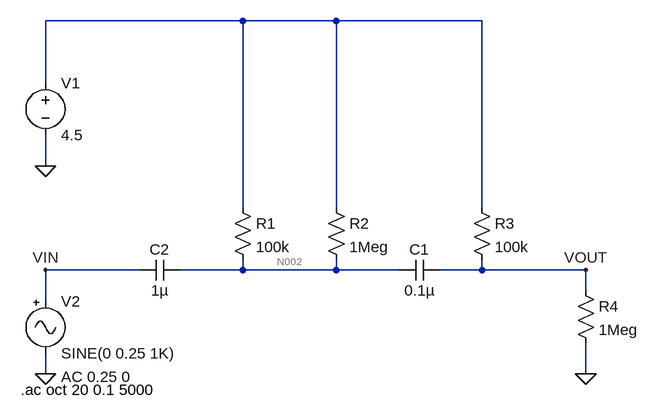
[diagram p0: schematic mt2_bypass.asc]
mt2_bypass.asc, the LTspice schematic file:
Version 4
SHEET 1 880 680
WIRE 48 -144 -256 -144
WIRE 192 -144 48 -144
WIRE 416 -144 192 -144
WIRE -256 -48 -256 -144
WIRE -256 80 -256 32
WIRE 48 144 48 -144
WIRE 192 144 192 -144
WIRE 416 144 416 -144
WIRE -112 240 -256 240
WIRE 48 240 48 224
WIRE 48 240 -48 240
WIRE 192 240 192 224
WIRE 192 240 48 240
WIRE 288 240 192 240
WIRE 416 240 416 224
WIRE 416 240 352 240
WIRE 576 240 416 240
WIRE 576 272 576 240
WIRE -256 288 -256 240
WIRE -256 400 -256 368
WIRE 576 400 576 352
FLAG -256 80 0
FLAG 576 400 0
FLAG -256 400 0
FLAG -256 240 VIN
FLAG 576 240 VOUT
SYMBOL res 32 128 R0
SYMATTR InstName R1
SYMATTR Value 100k
SYMBOL res 176 128 R0
SYMATTR InstName R2
SYMATTR Value 1Meg
SYMBOL res 400 128 R0
SYMATTR InstName R3
SYMATTR Value 100k
SYMBOL res 560 256 R0
SYMATTR InstName R4
SYMATTR Value 1Meg
SYMBOL cap 352 224 R90
WINDOW 0 0 32 VBottom 2
WINDOW 3 32 32 VTop 2
SYMATTR InstName C1
SYMATTR Value 0.1µ
SYMBOL cap -48 224 R90
WINDOW 0 0 32 VBottom 2
WINDOW 3 32 32 VTop 2
SYMATTR InstName C2
SYMATTR Value 1µ
SYMATTR SpiceLine V=200 Irms=0 Rser=0 Lser=0
SYMBOL voltage -256 -64 R0
WINDOW 123 0 0 Left 0
WINDOW 39 0 0 Left 0
SYMATTR InstName V1
SYMATTR Value 4.5
SYMBOL Misc\\signal -256 272 R0
WINDOW 123 24 132 Left 2
WINDOW 39 0 0 Left 0
SYMATTR InstName V2
SYMATTR Value SINE(0 0.25 1K)
SYMATTR Value2 AC 0.25 0
TEXT -294 424 Left 2 !.ac oct 20 0.1 5000

The netlist it stands for:
* mt2_bypass.asc
R1 N001 N002 100k
R2 N001 N002 1Meg
R3 N001 VOUT 100k
R4 VOUT 0 1Meg
C1 VOUT N002 0.1µ
C2 N002 VIN 1µ V=200 Irms=0 Rser=0 Lser=0
V1 N001 0 4.5
V2 VIN 0 SINE(0 0.25 1K) AC 0.25 0
.ac oct 20 0.1 5000
.backanno
.end

* Results of the author's LTspice run, read from the files saved beside the schematic
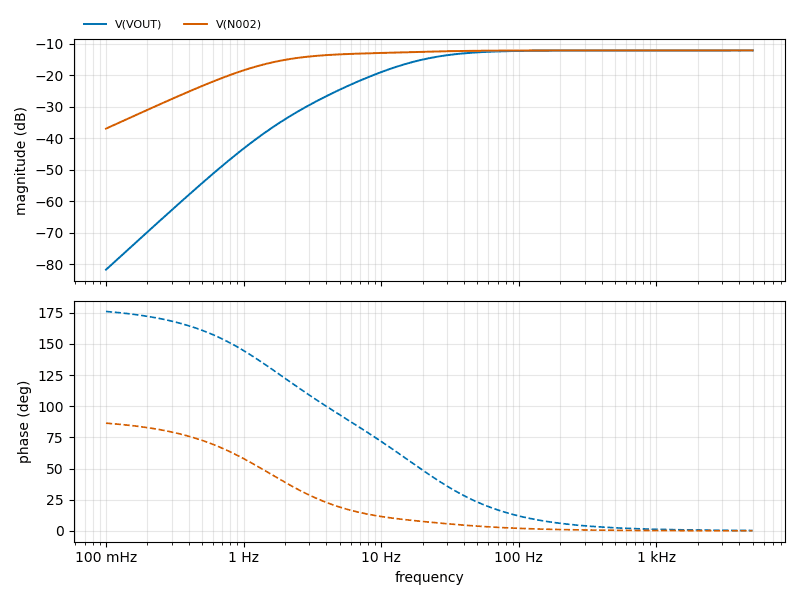
[diagram p1: AC Analysis of mt2_bypass.asc, plotted from the saved traces]
* AC Analysis, 1 run:
*   V(VOUT): -81.79 dB at 100 mHz, -12.04 dB at 5 kHz, peak -12.04 dB at 5 kHz, 3 dB below the peak at 19.56 Hz
*   V(N002): -36.92 dB at 100 mHz, -12.04 dB at 5 kHz, peak -12.04 dB at 5 kHz, 3 dB below the peak at 1.992 Hz